# EAGLE design iridia-tam-main-board (EAGLE 6.4)

## Sheet 1 of 3
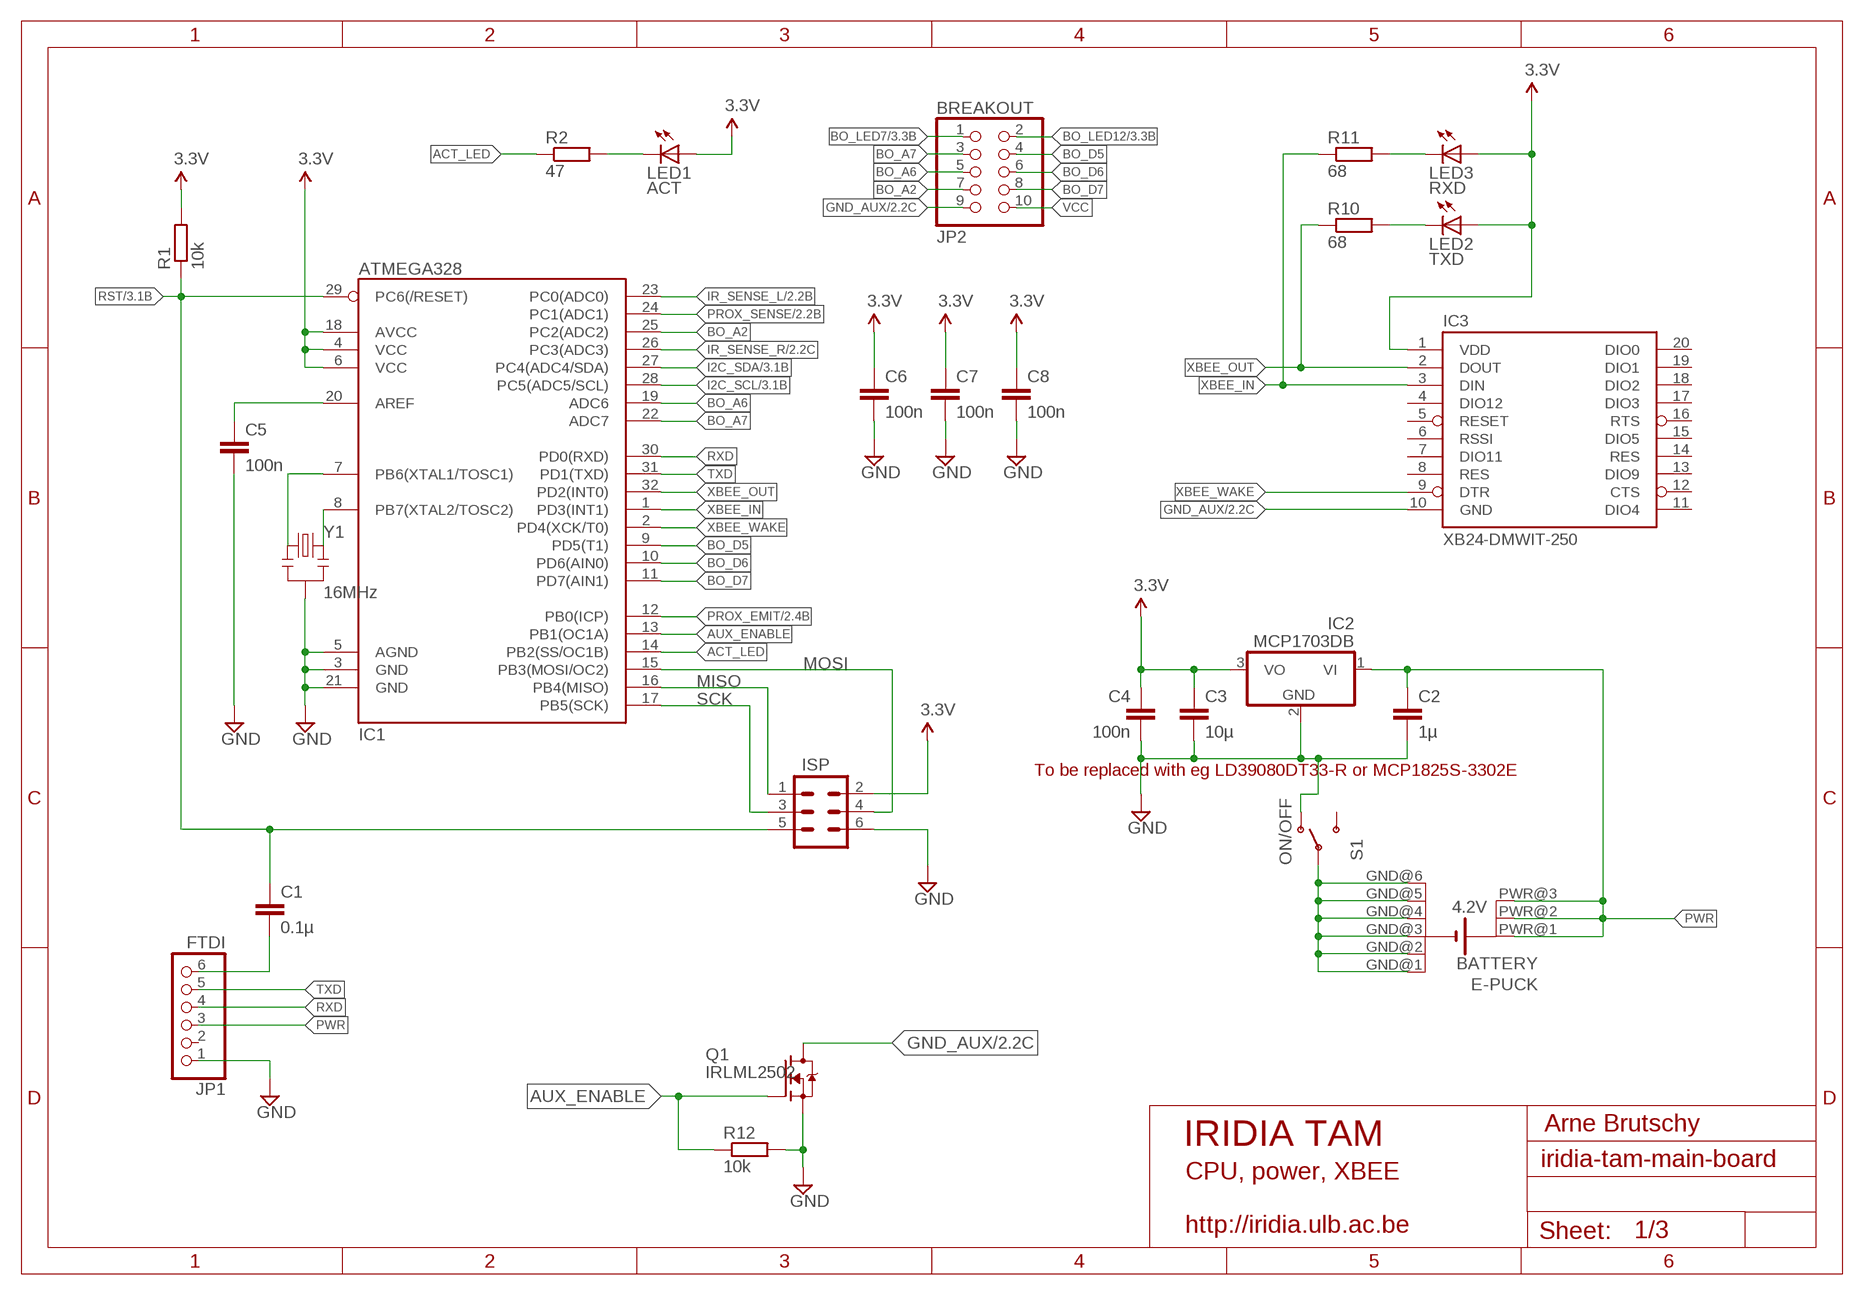
[diagram p0: schematic, sheet 1]

### Parts
BREAKOUT  JP2  PINHD-2X5_2.54-SMD  [2X05SMD]
C1  0.1µ  CAP0805  [0805]
C2  1µ  CAP0805  [0805]
C3  10µ  CAP0805  [0805]
C4  100n  CAP0805  [0805]
C5  100n  CAP0805  [0805]
C6  100n  CAP0805  [0805]
C7  100n  CAP0805  [0805]
C8  100n  CAP0805  [0805]
IC1  ATMEGA328  ATMEGA168  [TQFP32-08]
IC2  MCP1703DB  [SOT223]
IC3  XB24-DMWIT-250  XBEE-1B3  [XBEE-SMD]
JP1  FTDI  PINHD-1X6_2.54-SMD-90°  [1X06SMD/90]
LED1  ACT  LED1206  [LED-1206]
LED2  TXD  LEDCHIPLED_0805  [CHIPLED_0805]
LED3  RXD  LEDCHIPLED_0805  [CHIPLED_0805]
Q1  IRLML2502  [SOT23-3]
R1  10k  R-EU_R0805  [R0805]
R2  47  R-EU_R0805  [R0805]
R10  68  R-EU_R0805  [R0805]
R11  68  R-EU_R0805  [R0805]
R12  10k  R-EU_R0805  [R0805]
S1  ON/OFF  TOGGLESW200MSP1T2B2M6RE  [200USP1T1A1M6RE]
SV1  ISP  MA03-2  [MA03-2]
U$4  EPUCK_BATTERY  [EPUCK_BATTERY]
Y1  16MHz  RESONATOR16MHZ  [RESONATOR-SMD]

### Nets
ACT_LED: IC1.14(PB2(SS/OC1B)) R2.1
AUX_ENABLE: IC1.13(PB1(OC1A)) Q1.1(G) R12.1
BO_A2: BREAKOUT.7 IC1.25(PC2(ADC2))
BO_A6: BREAKOUT.5 IC1.19(ADC6)
BO_A7: BREAKOUT.3 IC1.22(ADC7)
BO_D5: BREAKOUT.4 IC1.9(PD5(T1))
BO_D6: BREAKOUT.6 IC1.10(PD6(AIN0))
BO_D7: BREAKOUT.8 IC1.11(PD7(AIN1))
BO_LED7: BREAKOUT.1 ; also sheet 3
BO_LED12: BREAKOUT.2 ; also sheet 3
FTDI_RST: C1.2 JP1.6
GND [gnd]: C2.2 C3.2 C4.2 C5.2 C6.2 C7.2 C8.2 IC1.3(GND) IC1.5(AGND) IC1.21(GND) IC2.2(GND) JP1.1 Q1.2(S) R12.2 S1.A SV1.6 Y1.2 ; also sheet 3
GND_AUX [gnd]: BREAKOUT.9 IC3.10(GND) Q1.3(D) ; also sheet 2,3
GND_BATT [gnd]: S1.COM U$4.GND@1(-1) U$4.GND@2(-2) U$4.GND@3(-3) U$4.GND@4(-4) U$4.GND@5(-5) U$4.GND@6(-6)
I2C_SCL: IC1.28(PC5(ADC5/SCL)) ; also sheet 3
I2C_SDA: IC1.27(PC4(ADC4/SDA)) ; also sheet 3
IR_SENSE_L: IC1.23(PC0(ADC0)) ; also sheet 2
IR_SENSE_R: IC1.26(PC3(ADC3)) ; also sheet 2
MISO: IC1.16(PB4(MISO)) SV1.1
MOSI: IC1.15(PB3(MOSI/OC2)) SV1.4
N$1: IC1.7(PB6(XTAL1/TOSC1)) Y1.1
N$8: C5.1 IC1.20(AREF)
N$11: IC1.8(PB7(XTAL2/TOSC2)) Y1.3
N$13: LED2.C R10.2
N$15: LED3.C R11.2
N$16: LED1.C R2.2
PROX_EMIT: IC1.12(PB0(ICP)) ; also sheet 2
PROX_SENSE: IC1.24(PC1(ADC1)) ; also sheet 2
PWR [power]: C2.1 IC2.1(VI) JP1.3 U$4.PWR@1(+1) U$4.PWR@2(+2) U$4.PWR@3(+3)
RST: C1.1 IC1.29(PC6(/RESET)) R1.1 SV1.5 ; also sheet 3
RXD: IC1.30(PD0(RXD)) JP1.4
SCK: IC1.17(PB5(SCK)) SV1.3
TXD: IC1.31(PD1(TXD)) JP1.5
VCC [power]: BREAKOUT.10 C3.1 C4.1 C6.1 C7.1 C8.1 IC1.4(VCC) IC1.6(VCC) IC1.18(AVCC) IC2.3(VO) IC3.1(VDD) LED1.A LED2.A LED3.A R1.2 SV1.2 ; supply symbol labelled 3.3V ; also sheet 2,3
XBEE_IN: IC1.1(PD3(INT1)) IC3.3(DIN) R11.1
XBEE_OUT: IC1.32(PD2(INT0)) IC3.2(DOUT) R10.1
XBEE_WAKE: IC1.2(PD4(XCK/T0)) IC3.9(DTR)
Unconnected: IC3.4(DIO12) IC3.5(RESET) IC3.6(RSSI) IC3.7(DIO11) IC3.8(RES) IC3.11(DIO4) IC3.12(CTS) IC3.13(DIO9) IC3.14(RES) IC3.15(DIO5) IC3.16(RTS) IC3.17(DIO3) IC3.18(DIO2) IC3.19(DIO1) IC3.20(DIO0) JP1.2 S1.B

### Notes on the sheet
- To be replaced with eg LD39080DT33-R or MCP1825S-3302E
- Arne Brutschy
- IRIDIA TAM
- CPU, power, XBEE
- http://iridia.ulb.ac.be

## Sheet 2 of 3
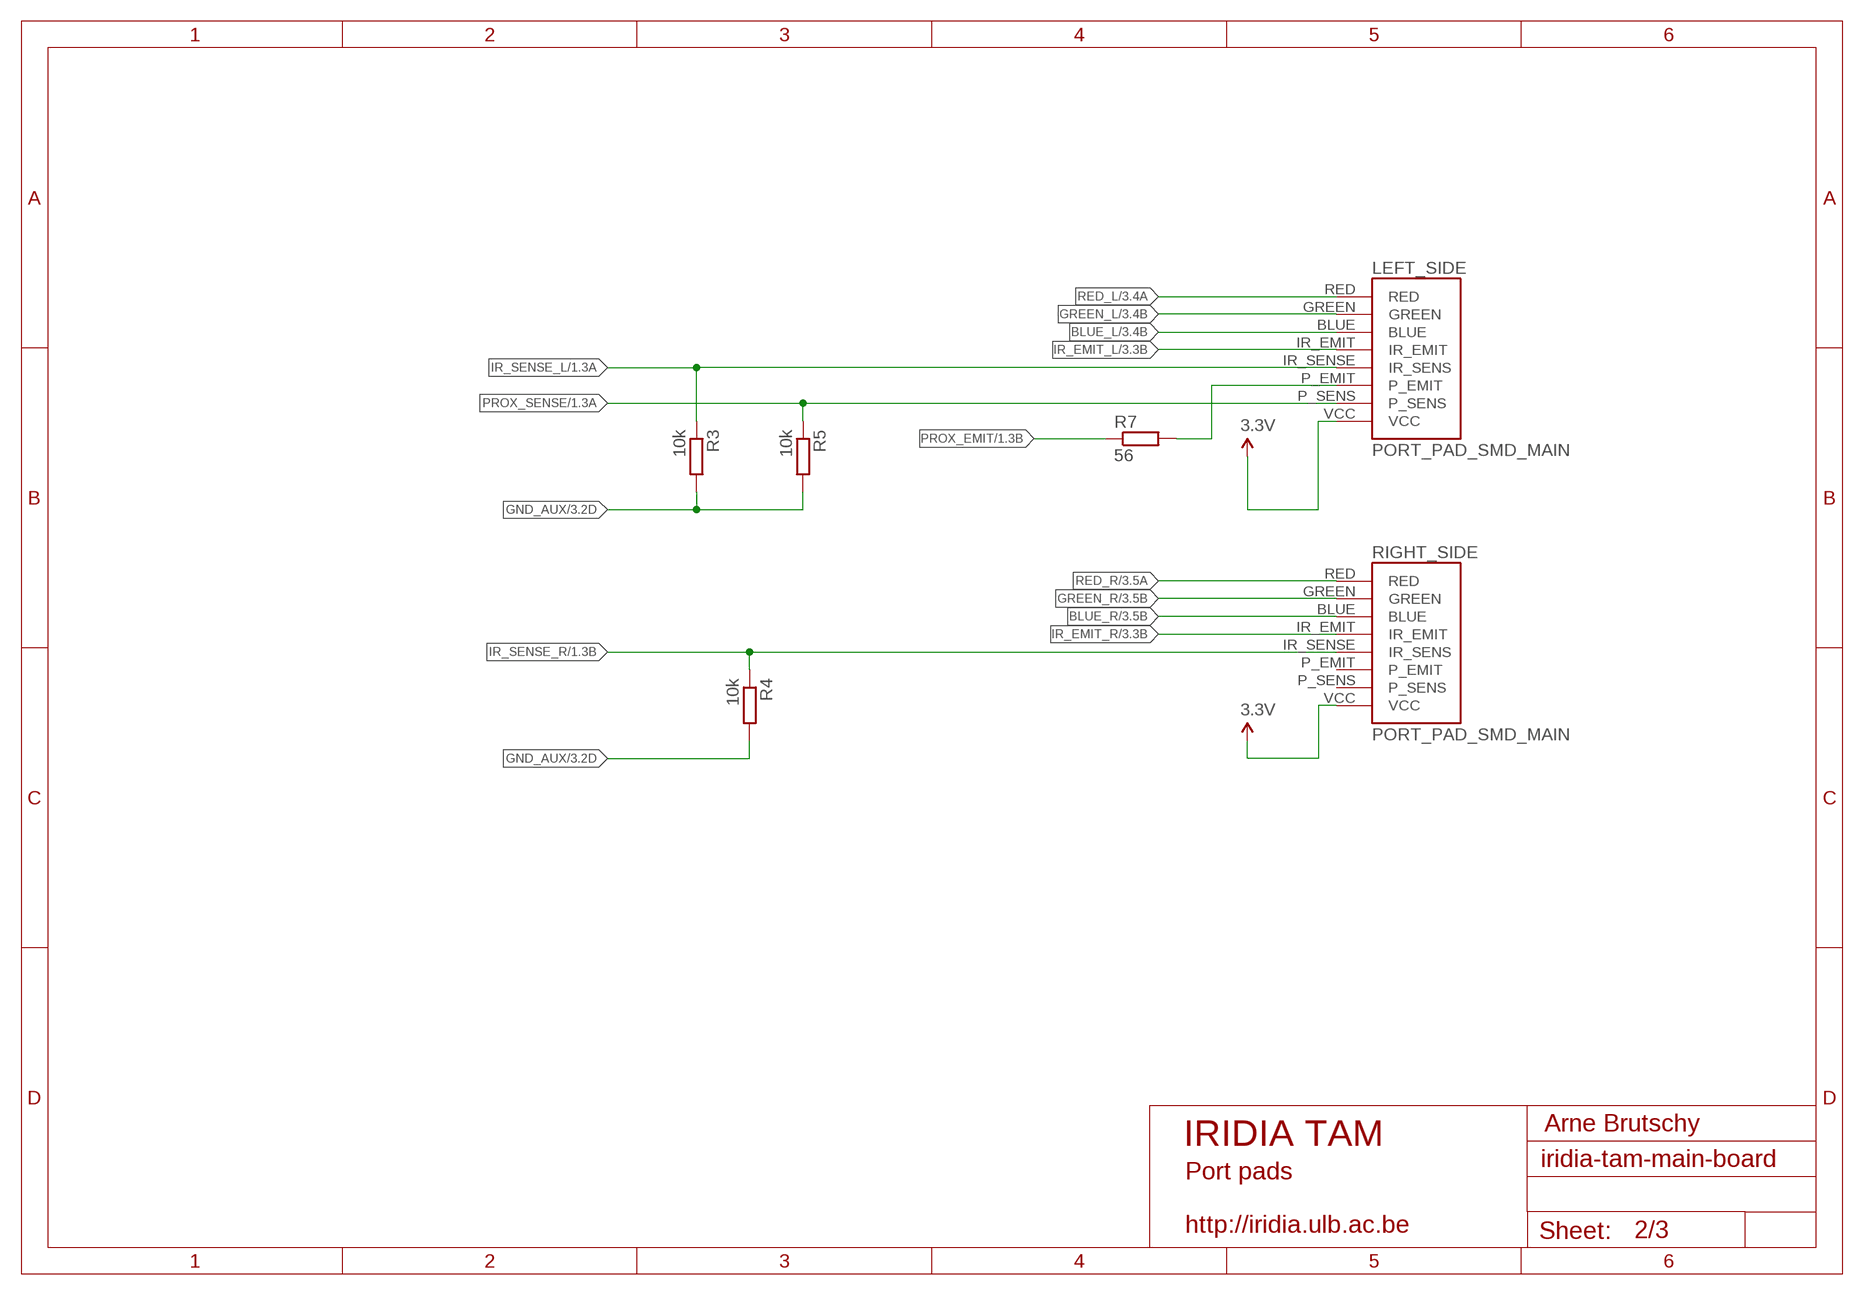
[diagram p1: schematic, sheet 2]

### Parts
LEFT_SIDE  PORT_PAD_SMD_MAIN  [PORT_PAD_SMD_MAIN]
R3  10k  R-EU_R0805  [R0805]
R4  10k  R-EU_R0805  [R0805]
R5  10k  R-EU_R0805  [R0805]
R7  56  R-EU_R0805  [R0805]
RIGHT_SIDE  PORT_PAD_SMD_MAIN  [PORT_PAD_SMD_MAIN]

### Nets
BLUE_L: LEFT_SIDE.BLUE ; also sheet 3
BLUE_R: RIGHT_SIDE.BLUE ; also sheet 3
GND_AUX [gnd]: R3.2 R4.2 R5.2 ; also sheet 1,3
GREEN_L: LEFT_SIDE.GREEN ; also sheet 3
GREEN_R: RIGHT_SIDE.GREEN ; also sheet 3
IR_EMIT_L: LEFT_SIDE.IR_EMIT ; also sheet 3
IR_EMIT_R: RIGHT_SIDE.IR_EMIT ; also sheet 3
IR_SENSE_L: LEFT_SIDE.IR_SENSE(IR_SENS) R3.1 ; also sheet 1
IR_SENSE_R: R4.1 RIGHT_SIDE.IR_SENSE(IR_SENS) ; also sheet 1
N$2: LEFT_SIDE.P_EMIT R7.2
PROX_EMIT: R7.1 ; also sheet 1
PROX_SENSE: LEFT_SIDE.P_SENS R5.1 ; also sheet 1
RED_L: LEFT_SIDE.RED ; also sheet 3
RED_R: RIGHT_SIDE.RED ; also sheet 3
VCC [power]: LEFT_SIDE.VCC RIGHT_SIDE.VCC ; supply symbol labelled 3.3V ; also sheet 1,3
Unconnected: RIGHT_SIDE.P_EMIT RIGHT_SIDE.P_SENS

### Notes on the sheet
- Arne Brutschy
- IRIDIA TAM
- Port pads
- http://iridia.ulb.ac.be

## Sheet 3 of 3
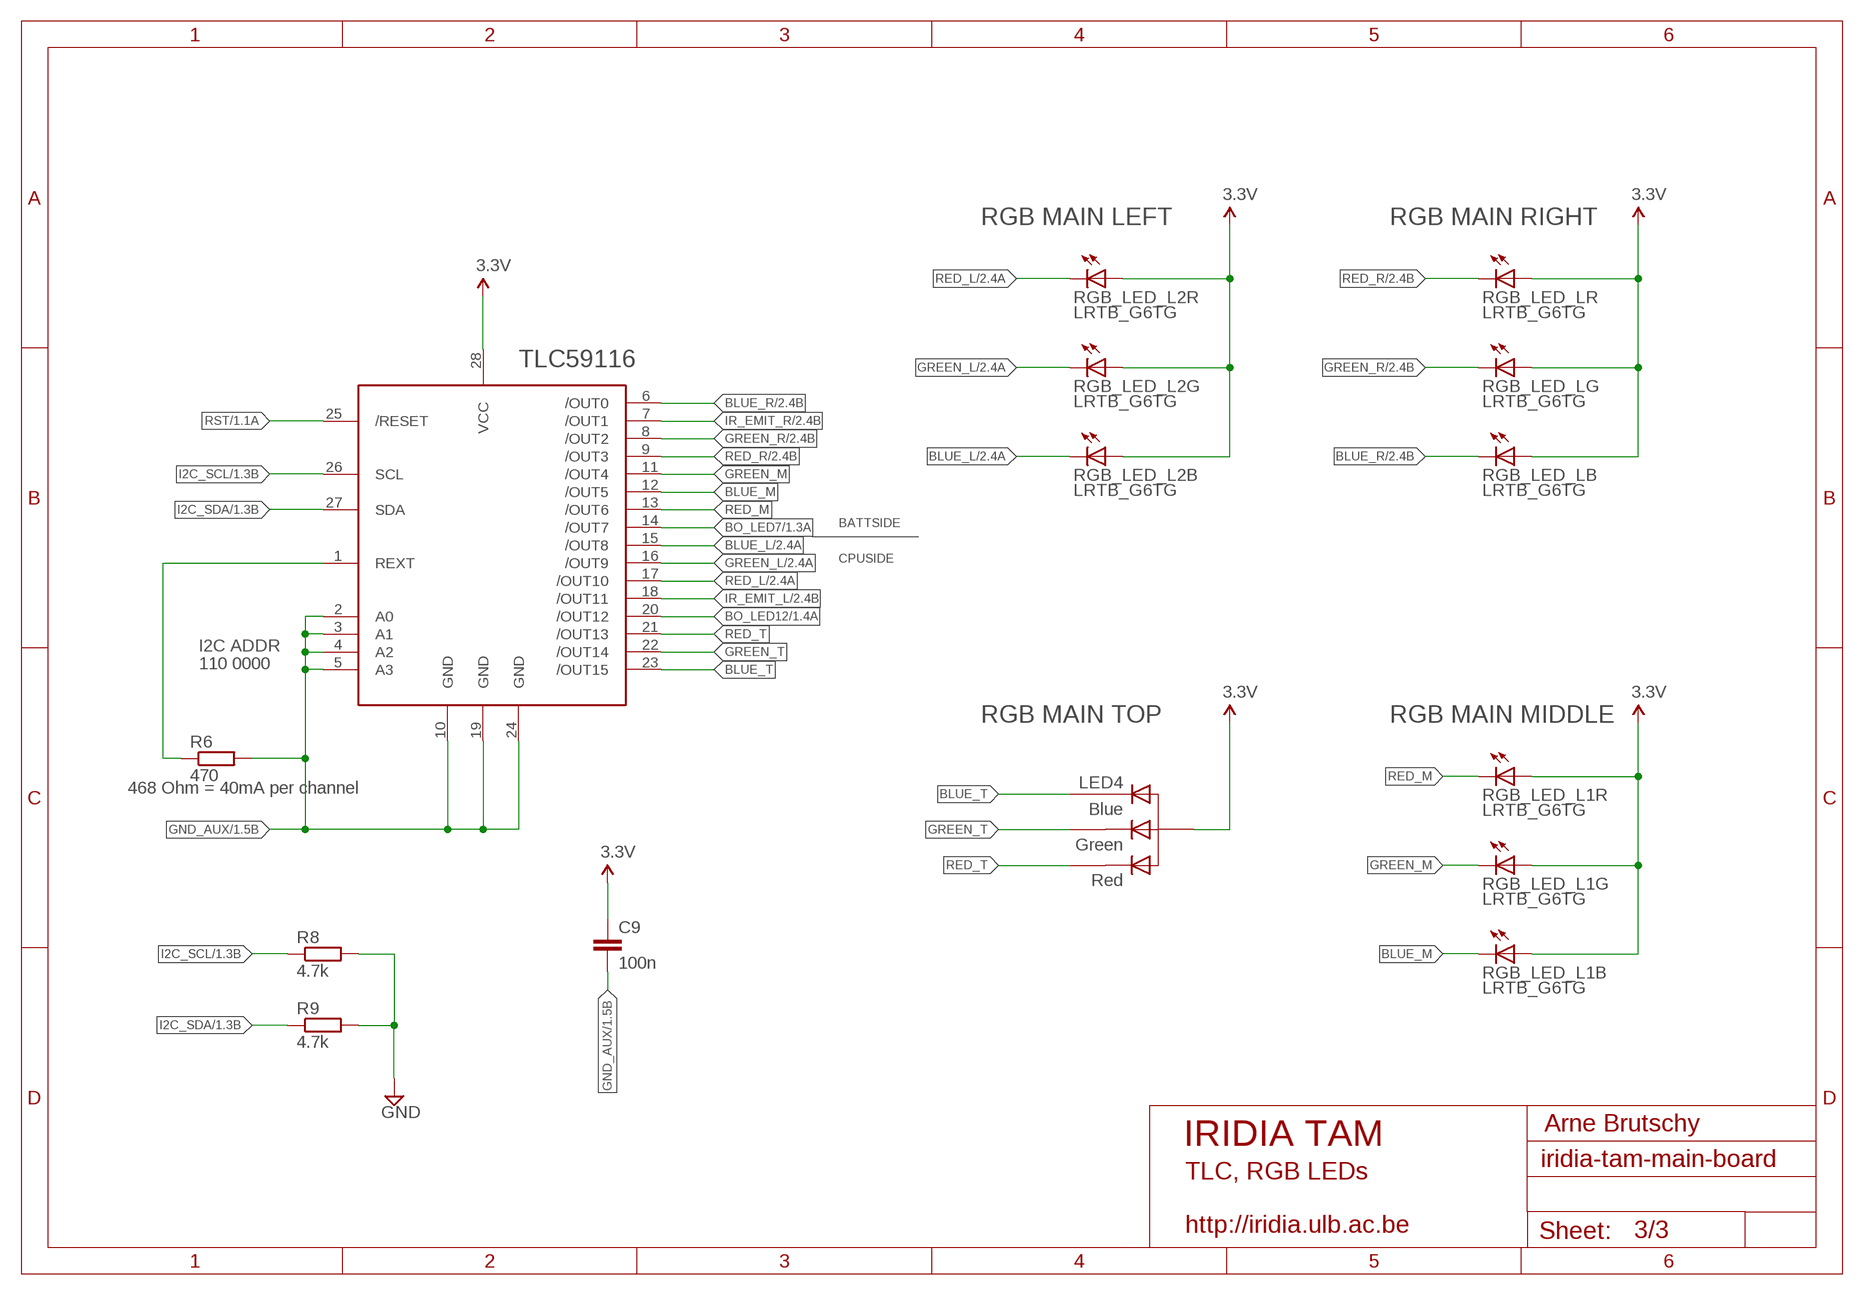
[diagram p2: schematic, sheet 3]

### Parts
C9  100n  CAP0805  [0805]
IC4  TLC59116  [TSSOP28]
LED4  RGBLED_CA5MMTROUGHHOLE  [LED5MMRGB]
R6  470  R-EU_R0805  [R0805]
R8  4.7k  R-EU_R0805  [R0805]
R9  4.7k  R-EU_R0805  [R0805]
RGB_LED_L  LRTB_G6TG  MULTILED_LRTB_G6TG  [P-LCC-6_TOPLED]
RGB_LED_L1  LRTB_G6TG  MULTILED_LRTB_G6TG  [P-LCC-6_TOPLED]
RGB_LED_L2  LRTB_G6TG  MULTILED_LRTB_G6TG  [P-LCC-6_TOPLED]

### Nets
BLUE_L: IC4.15(/OUT8) RGB_LED_L2.C3(B:C) ; also sheet 2
BLUE_M: IC4.12(/OUT5) RGB_LED_L1.C3(B:C)
BLUE_R: IC4.6(/OUT0) RGB_LED_L.C3(B:C) ; also sheet 2
BLUE_T: IC4.23(/OUT15) LED4.4(CB)
BO_LED7: IC4.14(/OUT7) ; also sheet 1
BO_LED12: IC4.20(/OUT12) ; also sheet 1
GND [gnd]: R8.2 R9.2 ; also sheet 1
GND_AUX [gnd]: C9.2 IC4.2(A0) IC4.3(A1) IC4.4(A2) IC4.5(A3) IC4.10(GND) IC4.19(GND) IC4.24(GND) R6.2 ; also sheet 1,2
GREEN_L: IC4.16(/OUT9) RGB_LED_L2.C2(G:C) ; also sheet 2
GREEN_M: IC4.11(/OUT4) RGB_LED_L1.C2(G:C)
GREEN_R: IC4.8(/OUT2) RGB_LED_L.C2(G:C) ; also sheet 2
GREEN_T: IC4.22(/OUT14) LED4.3(CG)
I2C_SCL: IC4.26(SCL) R8.1 ; also sheet 1
I2C_SDA: IC4.27(SDA) R9.1 ; also sheet 1
IR_EMIT_L: IC4.18(/OUT11) ; also sheet 2
IR_EMIT_R: IC4.7(/OUT1) ; also sheet 2
RED_L: IC4.17(/OUT10) RGB_LED_L2.C1(R:C) ; also sheet 2
RED_M: IC4.13(/OUT6) RGB_LED_L1.C1(R:C)
RED_R: IC4.9(/OUT3) RGB_LED_L.C1(R:C) ; also sheet 2
RED_T: IC4.21(/OUT13) LED4.1(CR)
REXT: IC4.1(REXT) R6.1
RST: IC4.25(/RESET) ; also sheet 1
VCC [power]: C9.1 IC4.28(VCC) LED4.2(A) RGB_LED_L1.A1(R:A) RGB_LED_L1.A2(G:A) RGB_LED_L1.A3(B:A) RGB_LED_L2.A1(R:A) RGB_LED_L2.A2(G:A) RGB_LED_L2.A3(B:A) RGB_LED_L.A1(R:A) RGB_LED_L.A2(G:A) RGB_LED_L.A3(B:A) ; supply symbol labelled 3.3V ; also sheet 1,2

### Notes on the sheet
- RGB MAIN LEFT | RGB MAIN RIGHT
- TLC59116
- BATTSIDE
- CPUSIDE
- I2C ADDR
- 110 0000
- RGB MAIN TOP | RGB MAIN MIDDLE
- 468 Ohm = 40mA per channel
- Arne Brutschy
- IRIDIA TAM
- TLC, RGB LEDs
- http://iridia.ulb.ac.be

## Library data of the parts
BREAKOUT = pinhead:PINHD-2X5: PIN HEADER
C1-C9 = SparkFun:CAP: Capacitor Standard 0603 ceramic capacitor, and 0.1" leaded capacitor.
IC1 = SparkFun:ATMEGA168
IC2 = linear:MCP1703: 250 mA, 16V, Low Quiescent Current LDO Regulator Source: http://ww1.microchip.com/downloads/en/DeviceDoc/22049b.pdf
IC3 = SparkFun-RF:XBEE-1: Xbee module footprints SMT header is CONN-09042.; PROD_ID: CONN-09042
IC4 = iridia:TLC59116: 16-CHANNEL FAST-MODE PLUS I2C BUS LED DRIVER Digi-Key Part Number 296-23354-1-ND Manufacturer Part Number TLC59116IPWR (TLC59116F)
JP1 = pinhead:PINHD-1X6: PIN HEADER
LED1 = SparkFun:LED: LEDs Standard schematic elements and footprints for 5mm, 3mm, 1206, and 0603 sized LEDs. 5mm - Spark Fun Electronics SKU : COM-00529 (and others)
LED2 LED3 = led:LED: LED OSRAM: - CHIPLED LG R971, LG N971, LY N971, LG Q971, LY Q971, LO R971, LY R971 LH N974, LH R974 LS Q976, LO Q976, LY Q976 LO Q996 - Hyper CHIPLED LW Q18S LB Q993, LB Q99A, LB R99A - SideLED LS A670, LO A670, LY A670, LG A670, LP A670 LB A673, LV A673, LT A673, LW A673 LH A674 LY A675 LS A676, LA A676, LO A676, LY A676, LW A676 LS A679, LY A679, LG A679 - Hyper Micro SIDELED® LS Y876, LA Y876, LO Y876, LY Y876 LT Y87S - SmartLED LW L88C, LW L88S LB L89C, LB L89S, LG L890 LS L89K, LO L89K, LY L89K LS L896, LA L896, LO L896, LY L896 - TOPLED LS T670, LO T670, LY T670, LG T670, LP T670 LSG T670, LSP T670, LSY T670, LOP T670, LYG T670 LG T671, LOG T671, LSG T671 LB T673, LV T673, LT T673, LW T673 LH T674 LS T676, LA T676, LO T676, LY T676, LB T676, LH T676, LSB T676, LW T676 LB T67C, LV T67C, LT T67C, LS T67K, LO T67K, LY T67K, LW E67C LS E67B, LA E67B, LO E67B, LY E67B, LB E67C, LV E67C, LT E67C LW T67C LS T679, LY T679, LG T679 LS T770, LO T770, LY T770, LG T770, LP T770 LB T773, LV T773, LT T773, LW T773 LH T774 LS E675, LA E675, LY E675, LS T675 LS T776, LA T776, LO T776, LY T776, LB T776 LHGB T686 LT T68C, LB T68C - Hyper Mini TOPLED® LB M676 - Mini TOPLED Santana® LG M470 LS M47K, LO M47K, LY M47K Source: http://www.osram.convergy.de LUXEON: - LUMILED® LXK2-PW12-R00, LXK2-PW12-S00, LXK2-PW14-U00, LXK2-PW14-V00 LXK2-PM12-R00, LXK2-PM12-S00, LXK2-PM14-U00 LXK2-PE12-Q00, LXK2-PE12-R00, LXK2-PE12-S00, LXK2-PE14-T00, LXK2-PE14-U00 LXK2-PB12-K00, LXK2-PB12-L00, LXK2-PB12-M00, LXK2-PB14-N00, LXK2-PB14-P00, LXK2-PB14-Q00 LXK2-PR12-L00, LXK2-PR12-M00, LXK2-PR14-Q00, LXK2-PR14-R00 LXK2-PD12-Q00, LXK2-PD12-R00, LXK2-PD12-S00 LXK2-PH12-R00, LXK2-PH12-S00 LXK2-PL12-P00, LXK2-PL12-Q00, LXK2-PL12-R00 Source: www.luxeon.com KINGBRIGHT: KA-3528ASYC Source: www.kingbright.com
LED4 = iridia:RGBLED_CA: RGB LED, common-anode 5MM Staggered pins YSL-R596AR3G4B5C-C10 https://www.sparkfun.com/products/10821 BL-L515RGBW-CA http://www.adafruit.com/products/159
LEFT_SIDE RIGHT_SIDE = iridia:PORT_PAD_SMD_MAIN: Connector pad for soldering side boards on main board of IRIDIA TAM
Q1 = iridia:IRLML2502: International Rectifier N-MOSFET.
R1-R12 = resistor:R-EU_: RESISTOR, European symbol
RGB_LED_L RGB_LED_L1 RGB_LED_L2 = led:MULTILED_LRTB_G6TG: 6-lead MULTILED® Enhanced optical Power LED (ThinFilm® / ThinGaN®) Source. OSRAM - LRTB_G6TG.pdf
S1 = iridia:TOGGLESW: Toggle Switches Digi-Key Part Number 432-1164-ND Manufacturer Carling Technologies Manufacturer Part Number 2M1-SP1-T2-B4-M6RE Description SW TOGGLE SPDT .4VA RT ANG PCB Digi-Key Part Number EG2448-ND Manufacturer E-Switch Manufacturer Part Number 200MSP1T2B2M6RE Description SWITCH TOGGLE SPDT .4VA RT ANG
SV1 = con-lstb:MA03-2: PIN HEADER
U$4 = iridia:EPUCK_BATTERY: E-Puck Battery Holder As on epuck charger
Y1 = iridia:RESONATOR: Resonator Digikey: CSTCE16M0V53-R0 Description CER RESONATOR 16.0MHZ SMD; PROD_ID: XTAL-08900

## Net classes
1 power: width 0.381 mm, clearance 0.254 mm
2 gnd: width 0.305 mm, drill 0.508 mm, clearance 0.152 mm

## Board
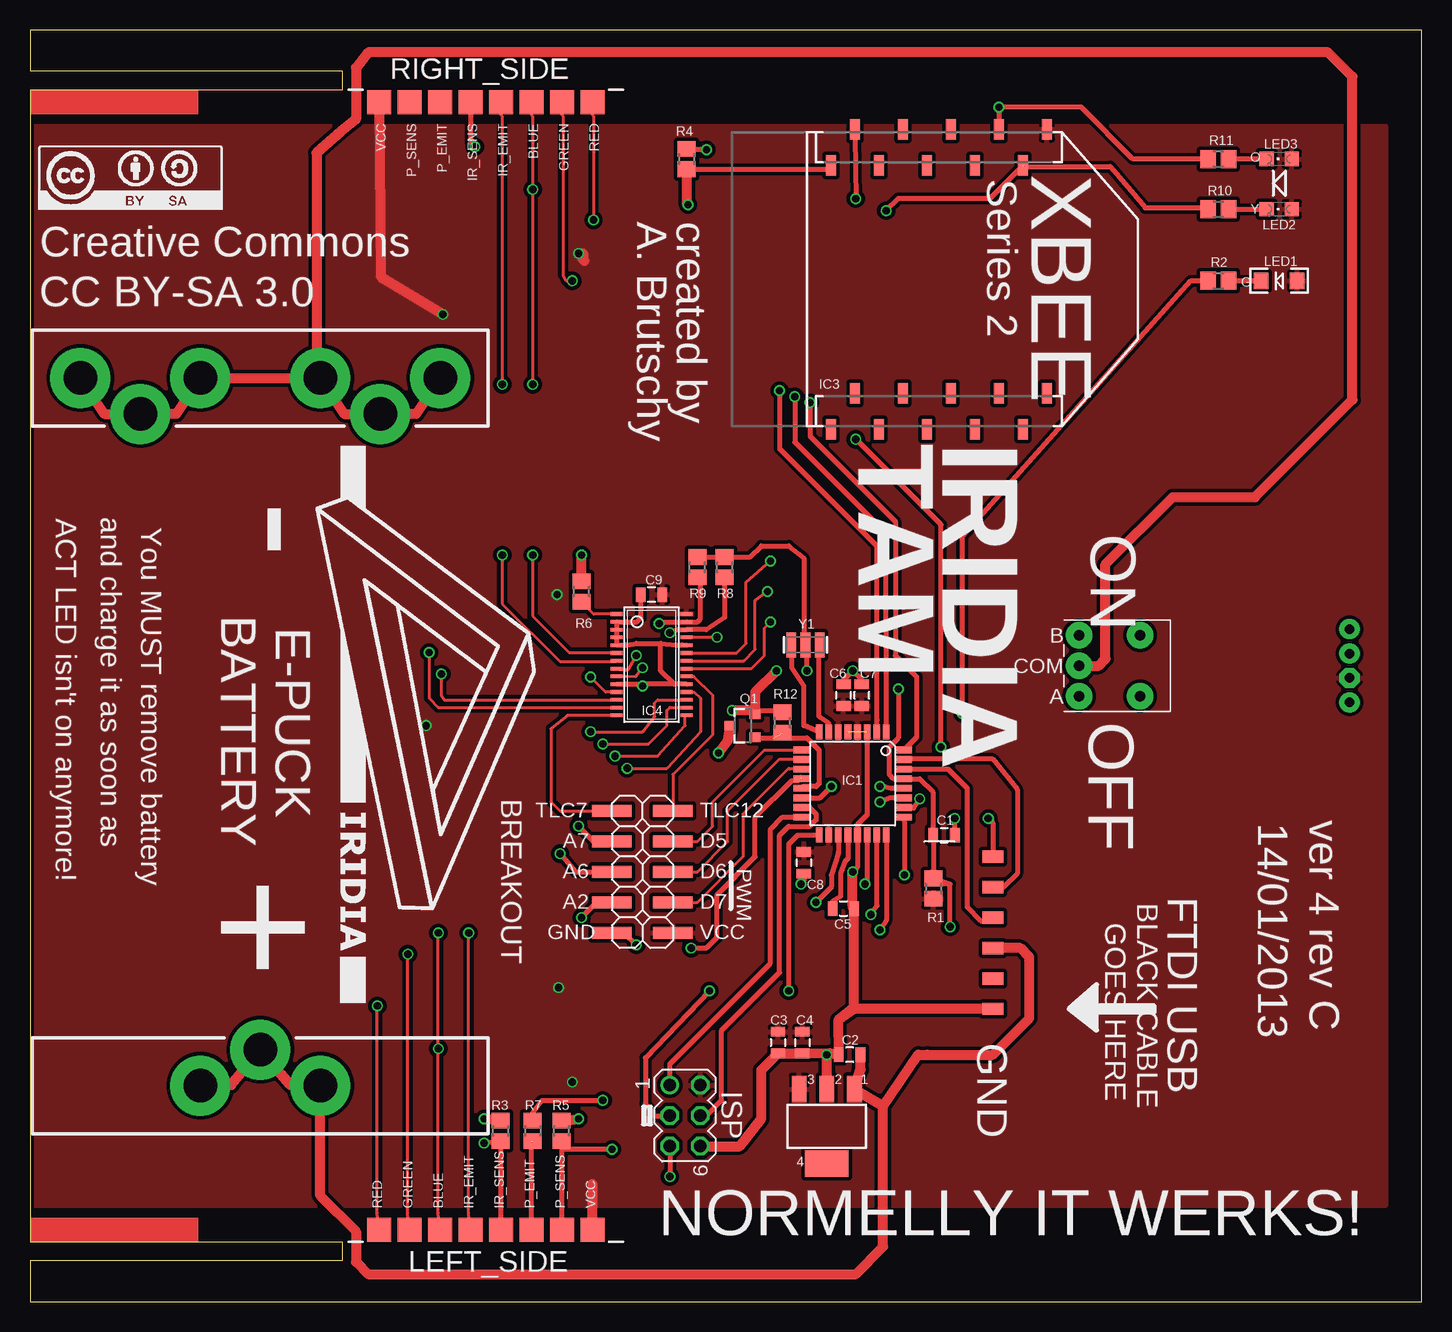
[diagram p3: board, top side]
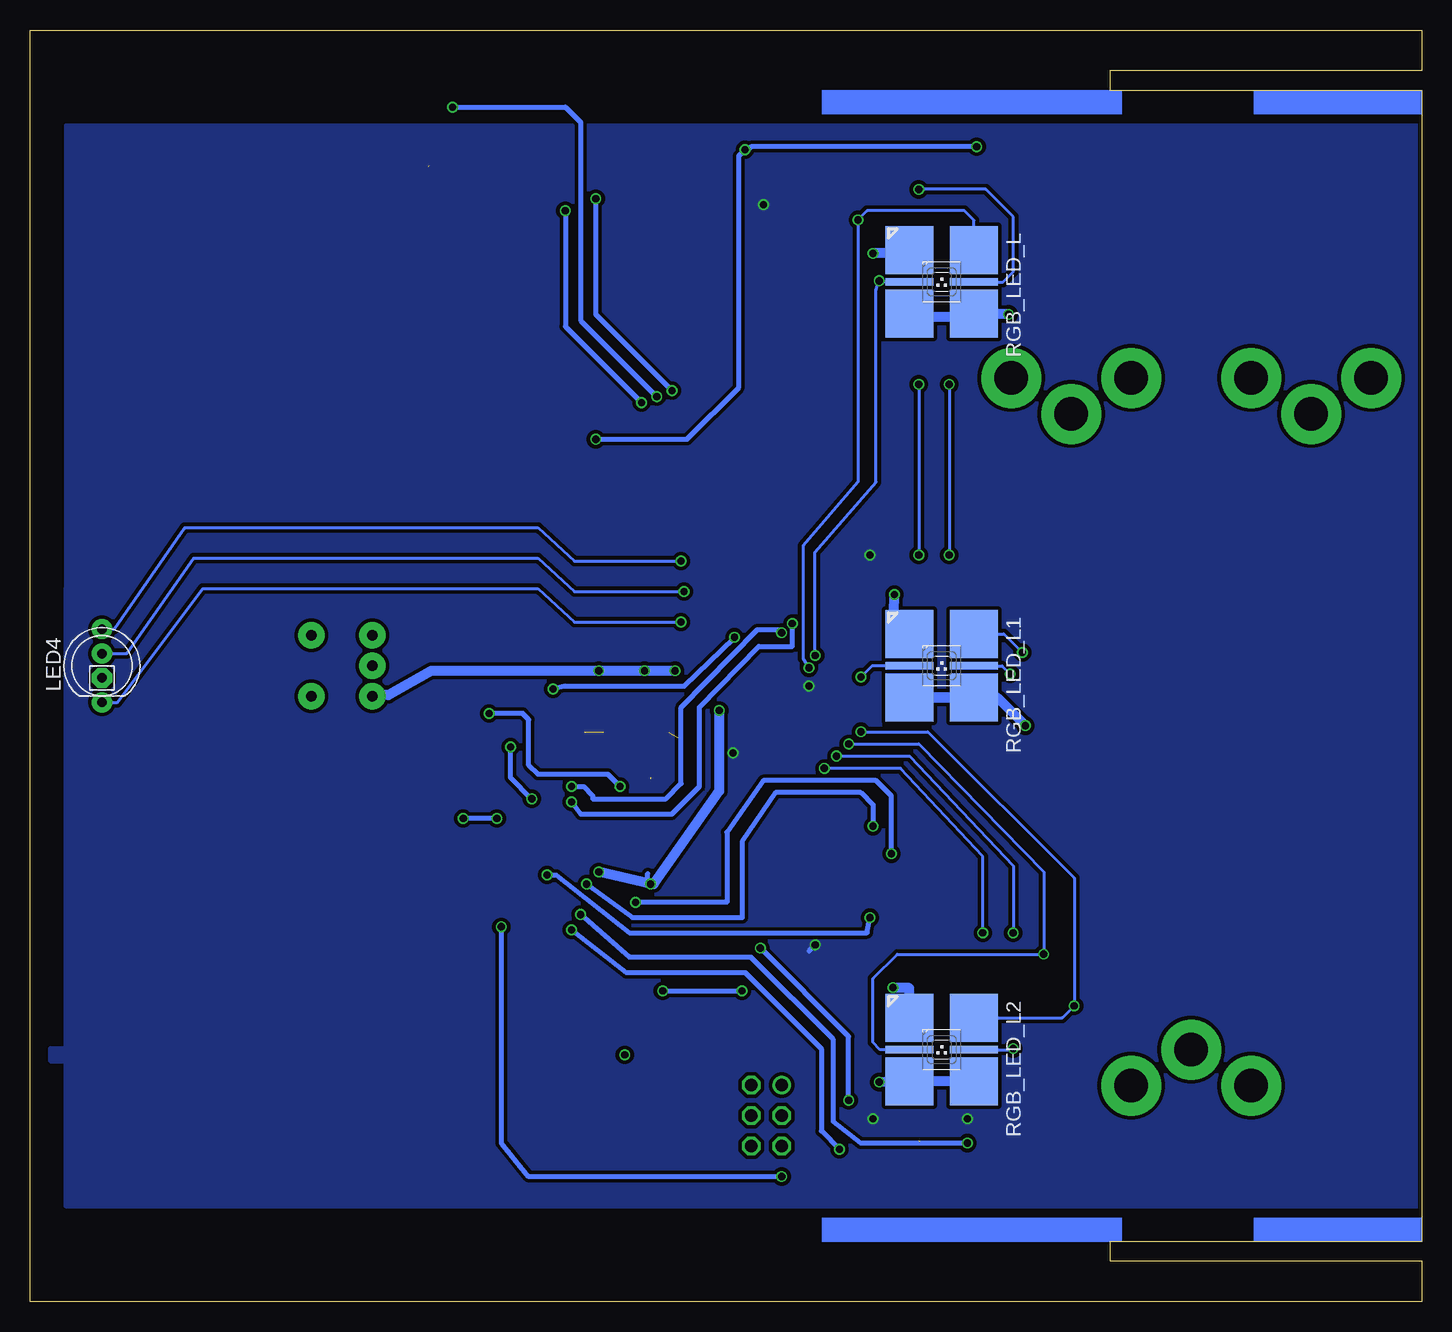
[diagram p4: board, bottom side, seen from below]

Size 116 x 106 mm. Coordinates in mm from the lower left corner, seen from the top.
Outline: 0,0 116,0 116,106 0,106 0,102.6 26,102.6 26,101 0,101 0,5 26,5 26,3.4 0,3.4 0,0
Copper layers (1*16): Top 0.035mm / dielectric 1.5mm / Bottom 0.035mm
Design rules "Fusion_eagle_rule_v1.1": minimum track width 6mil, minimum drill 12mil, track to track 6mil, track to pad 6mil, pad to pad 6mil, via to via 6mil, smd to smd 0mil, copper to edge 10mil, drill to drill 10mil, minimum pad ring 10mil, minimum via ring 6mil, stop-mask expansion 2mil, vias tented up to drill 100mil, thermal gap 10mil

### Footprints (pad centres in the part's own frame; a part is rotated, then mirrored left to right if it is on the bottom)
2X05SMD = smd 1.016 x 3.302: 1 -1.27,-3.81; 2 -1.27,1.27; 3 1.27,-3.81; 4 1.27,1.27; 5 3.81,-3.81; 6 3.81,1.27; 7 6.35,-3.81; 8 6.35,1.27; 9 8.89,-3.81; 10 8.89,1.27
0805 = smd 0.8 x 1.2: 1 -0.9,0; 2 0.9,0
TQFP32-08 = smd 1.27 x 0.559: 1 -4.293,2.8; 2 -4.293,2; 3 -4.293,1.2; 4 -4.293,0.4; 5 -4.293,-0.4; 6 -4.293,-1.2; 7 -4.293,-2; 8 -4.293,-2.8; 17 4.293,-2.8; 18 4.293,-2; 19 4.293,-1.2; 20 4.293,-0.4; 21 4.293,0.4; 22 4.293,1.2; 23 4.293,2; 24 4.293,2.8 | smd 0.559 x 1.27: 9 -2.8,-4.293; 10 -2,-4.293; 11 -1.2,-4.293; 12 -0.4,-4.293; 13 0.4,-4.293; 14 1.2,-4.293; 15 2,-4.293; 16 2.8,-4.293; 25 2.8,4.293; 26 2,4.293; 27 1.2,4.293; 28 0.4,4.293; 29 -0.4,4.293; 30 -1.2,4.293; 31 -2,4.293; 32 -2.8,4.293
SOT223 = smd 1.219 x 2.235: 1 -2.311,-3.099; 2 0,-3.099; 3 2.311,-3.099 | smd 3.6 x 2.2: 4 0,3.099
XBEE-SMD = smd 1.7 x 0.85: 1 -12.5,20; 2 -9.5,18; 3 -12.5,16; 4 -9.5,14; 5 -12.5,12; 6 -9.5,10; 7 -12.5,8; 8 -9.5,6; 9 -12.5,4; 10 -9.5,2; 11 12.5,2; 12 9.5,4; 13 12.5,6; 14 9.5,8; 15 12.5,10; 16 9.5,12; 17 12.5,14; 18 9.5,16; 19 12.5,18; 20 9.5,20
TSSOP28 = smd 0.305 x 0.991: 1 -4.225,-2.918; 2 -3.575,-2.918; 3 -2.925,-2.918; 4 -2.275,-2.918; 5 -1.625,-2.918; 6 -0.975,-2.918; 7 -0.325,-2.918; 8 0.325,-2.918; 9 0.975,-2.918; 10 1.625,-2.918; 11 2.275,-2.918; 12 2.925,-2.918; 13 3.575,-2.918; 14 4.225,-2.918; 15 4.225,2.918; 16 3.575,2.918; 17 2.925,2.918; 18 2.275,2.918; 19 1.625,2.918; 20 0.975,2.918; 21 0.325,2.918; 22 -0.325,2.918; 23 -0.975,2.918; 24 -1.625,2.918; 25 -2.275,2.918; 26 -2.925,2.918; 27 -3.575,2.918; 28 -4.225,2.918
1X06SMD/90 = smd 1.016 x 1.778: 1 -1.27,-5.08; 2 1.27,-5.08; 3 3.81,-5.08; 4 6.35,-5.08; 5 8.89,-5.08; 6 11.43,-5.08
LED-1206 = smd 1.2 x 1.4: A -1.5,0; C 1.5,0
CHIPLED_0805 = smd 1.2 x 1.2: A 0,-1.05; C 0,1.05
LED5MMRGB = drill 0.8 pad 1.676: 1 -3.048,0; 3 1.016,0; 4 3.048,0 | drill 0.8 pad 1.676 octagon: 2 -1.016,0
PORT_PAD_SMD_MAIN = smd 2 x 2: BLUE 0,3.81; GREEN 0,6.35; IR_EMIT 0,1.27; IR_SENSE 0,-1.27; P_EMIT 0,-3.81; P_SENS 0,-6.35; RED 0,8.89; VCC 0,-8.89
SOT23-3 = smd 0.8 x 0.9: 1 -0.95,-1; 2 0.95,-1; 3 0,1.1
R0805 = smd 1.3 x 1.5: 1 -0.85,0; 2 0.85,0
P-LCC-6_TOPLED = smd 4 x 4: A1 -2.65,-2.7; A2 2.65,-2.7; A3 2.65,2.7; C1 -2.65,2.7 | smd 0.6 x 4: C2 0,-2.7; C3 0,2.7
200USP1T1A1M6RE = drill 0.889 pad 2.184: 1 -2.54,2.54; 2 -2.54,-2.54; A 2.54,2.54; B 2.54,-2.54; COM 2.54,0
MA03-2 = drill 1.016: 1 -2.54,-1.27 | drill 1.016 octagon: 2 -2.54,1.27; 3 0,-1.27; 4 0,1.27; 5 2.54,-1.27; 6 2.54,1.27
EPUCK_BATTERY = drill 2.8 pad 5: GND@1 29,15; GND@2 26,10; GND@3 29,5; GND@4 29,-5; GND@5 26,-10; GND@6 29,-15; PWR@1 -30,5; PWR@2 -27,0; PWR@3 -30,-5
RESONATOR-SMD = smd 0.8 x 2.1: 1 -1.2,0; 2 0,0; 3 1.2,0

### Placement (x,y rotation side)
BREAKOUT  52.32,39.62 270 top
C1  76.2,38.86 0 top
C2  68.33,20.57 180 top
C3  62.36,21.59 270 top
C4  64.39,21.59 270 top
C5  67.82,32.77 0 top
C6  67.82,50.55 90 top
C7  69.34,50.55 90 top
C8  64.52,36.58 270 top
C9  51.82,58.93 180 top
IC1  68.58,43.18 270 top
IC2  66.42,14.61 180 top
IC3  64.77,85.22 270 top
IC4  51.82,53.09 270 top
JP1  75.18,25.65 90 top
LED1  104.14,85.09 180 top
LED2  104.14,91.06 90 top
LED3  104.14,95.25 90 top
LED4  110,53 90 bottom
LEFT_SIDE  38,6 90 top
Q1  59.44,48.01 90 top
R1  75.31,34.42 270 top
R2  99.06,85.09 0 top
R3  39.24,14.22 90 top
R4  54.74,95.25 270 top
R5  44.32,14.22 90 top
R6  45.97,59.18 90 top
R7  41.91,14.22 270 top
R8  57.91,61.21 90 top
R9  55.63,61.21 90 top
R10  99.06,91.06 0 top
R11  99.06,95.25 0 top
R12  62.74,48.26 90 top
RGB_LED_L  40,85 270 bottom
RGB_LED_L1  40,53 270 bottom
RGB_LED_L2  40,21 270 bottom
RIGHT_SIDE  38,100 270 top
S1  90,53 180 top
SV1  54.61,15.49 270 top
U$4  19.2,48 90 top
Y1  64.64,54.74 180 top

### Tracks (layer width: path | path; a pad name or v marks a point on that pad's centre or on a via)
ACT_LED  (via drill 0.6)
  Top 0.406: v77.72,49.02 77.72,63.75 96.77,85.09 98.3,85.09 | IC1.14 65.86,41.98 v66.8,42.93
  Top 0.813: R2.1 98.3,85.09
  Bottom 0.406: v66.8,42.93 67.82,43.94 73.66,43.94 74.42,44.7 74.42,48.51 74.93,49.02 v77.72,49.02
AUX_ENABLE  (1 unrouted)
  Top 0.406: Q1.1 60.69,46.97 61.98,46.99 64.77,46.99 65.79,45.97 65.79,43.18 65.53,42.93 64.43,42.93 IC1.13
BLUE_L  (via drill 0.6)
  Top 0.254: LEFT_SIDE.BLUE 34.04,7.37 v34.04,21.08 v34.04,30.73 34.04,30.99 | v48.77,45.47 52.32,45.47 54.61,48.01 54.61,48.74 IC4.15
  Bottom 0.254: RGB_LED_L2.C3 34.12,21 v34.04,21.08 | v48.77,45.47 42.67,45.47 34.04,36.32 v34.04,30.73
BLUE_M  (via drill 0.6)
  Top 0.254: v34.29,52.32 34.29,50.55 34.54,50.16 48.51,50.16 IC4.12
  Bottom 0.254: RGB_LED_L1.C3 34.97,53 v34.29,52.32
BLUE_R  (via drill 0.6)
  Top 0.254: RIGHT_SIDE.BLUE 41.81,98.91 41.91,98.81 v41.91,92.71 v41.91,76.45 | v41.91,62.23 41.91,57.15 44.96,54.1 48.86,54.1 IC4.6
  Bottom 0.254: RGB_LED_L.C3 34.89,85 34.04,85.85 34.04,90.42 36.32,92.71 v41.91,92.71 | v41.91,76.45 v41.91,62.23
BLUE_T  (via drill 0.6)
  Top 0.254: IC4.23 58.89,54.06 59.69,54.86 59.69,59.94 v61.72,61.72
  Bottom 0.254: LED4.4 108.97,56.05 103.12,64.52 73.66,64.52 70.61,61.72 v61.72,61.72
BO_A2  (via drill 0.6)
  Top 0.406: IC1.25 72.9,39.62 72.9,38.35 v72.9,35.56 | v45.97,32 47.24,33.27 BREAKOUT.7
  Bottom 0.406: v72.9,35.56 72.14,35.56 66.04,30.73 46.23,30.73 v45.97,32
BO_A6  (via drill 0.6)
  Top 0.406: IC1.19 67.38,37.41 66.8,35.56 66.8,34.54 v65.53,33.27 | v44.2,37.34 45.47,35.81 BREAKOUT.5
  Bottom 0.406: v44.2,37.34 44.2,42.16 45.47,43.43 54.86,43.43 57.91,39.12 57.91,33.27 v65.53,33.27
BO_A7  (via drill 0.6)
  Top 0.406: IC1.22 69.78,34.98 v69.6,34.8 | v45.72,39.62 46.99,38.35 BREAKOUT.3
  Bottom 0.406: v69.6,34.8 65.79,32 56.64,32 56.64,38.35 53.85,42.42 46.74,42.42 45.72,41.4 v45.72,39.62
BO_D5
  Top 0.254: BREAKOUT.4 55.63,38.35 56.9,39.62 56.9,41.66 61.21,45.97 IC1.9
BO_D6
  Top 0.254: BREAKOUT.6 55.63,35.81 58.17,38.35 58.17,40.89 62.48,45.21 64.25,45.21 IC1.10
BO_D7
  Top 0.254: IC1.11 63.32,44.38 63.25,44.45 59.44,40.64 59.44,37.08 55.63,33.27 BREAKOUT.8
BO_LED7
  Top 0.254: IC4.14 44.8,48.86 43.43,47.75 43.43,41.66 44.2,40.89 BREAKOUT.1
BO_LED12
  Top 0.254: IC4.20 55.33,52.11 56.9,50.55 56.9,47.24 53.59,43.94 BREAKOUT.2
FTDI_RST  (via drill 0.6)
  Top 0.406: C1.2 77.1,40.25 v77.09,40.26 | v79.88,40.26 80.26,39.88 JP1.6
  Bottom 0.406: v77.09,40.26 v79.88,40.26
GND  (via drill 0.6)  (1 unrouted)
  Top 0.406: 69.85,47.5 69.85,47.54 IC1.3 69.78,40.57 68.96,39.75 68.96,38.91 | 68.96,38.91 68.96,36.2 v68.58,35.81 | 68.96,38.91 IC1.21 | 60.44,49.26 62.59,49.26 R12.2 | v64.77,52.58 64.77,54.61 Y1.2 64.52,54.86 64.52,61.98 63.25,62.99 60.96,62.99 60.03,62.06 R8.2 R9.2 | C6.2 67.82,51.82 v68.58,52.58 69.34,51.82 C7.2 | C8.2 64.52,35.05 v64.26,34.8 64.26,35.42 C8.2
  Top 0.813: 66.67,20.71 C2.2 | IC2.2 v66.42,20.57 66.67,20.71 | 66.67,20.71 C4.2 C3.2 60.96,19.29 60.96,15.24 59.18,12.95 SV1.6 | Q1.2 60.44,49.26 | 60.44,49.26 v58.55,49.28 | C2.2 67.4,23.49 | 67.4,23.49 68.7,24.38 | 68.7,24.38 68.7,32.63 68.58,33.02 | C2.2 67.43,20.69 | 68.82,24.51 68.7,24.38 | v62.23,52.58 60.45,50.8 60.44,49.26 | 68.58,33.02 v68.58,35.81 | 68.58,33.02 68.58,32.88 C5.2 | JP1.1 68.7,24.38 | 68.7,24.38 68.54,24.38 67.4,23.49
  Bottom 0.406: v64.26,34.8 64.52,34.8 C8.2
  Bottom 0.813: v62.23,52.58 v64.77,52.58 v68.58,52.58 82.55,52.58 86.11,50.55 87.37,50.55 S1.A | v58.55,49.28 58.55,42.55 64.01,34.8 v64.26,34.8 v68.58,35.81
GND_AUX  (via drill 0.6)
  Top 0.406: 52.58,54.86 50.55,54.86 49.76,54.71 IC4.5 IC4.4 48.9,55.5 | 52.58,54.86 53.85,54.74 54.38,54.74 IC4.24 | 52.58,54.86 52.58,52.58 53.7,51.46 IC4.19 51.21,51.46 v51.05,51.31 50.9,51.46 IC4.10 | 48.9,55.5 IC4.3 IC4.2 50.56,56.66 | 48.9,55.5 48.77,55.37 | BREAKOUT.9 49.53,30.73 v50.55,29.72 | R4.2 66.45,94.4 IC3.10 | C9.2 50.92,57.01 50.56,56.66 | 50.56,56.66 50.55,56.64
  Top 0.813: R4.2 54.74,91.57 v54.86,91.44 | R6.2 v45.97,62.23 | Q1.3 58.17,46.74 v57.4,45.72 | R3.2 39.24,15.11 v37.85,15.24 | R5.2 44.54,15.07 v45.72,15.24
  Bottom 0.406: v50.55,29.72 50.8,29.72 50.8,29.46 51.05,29.21
  pour Bottom (isolate 0.305): 0,98 113,98 113.03,21.08 114.3,21.08 114.3,20.07 113.03,20.07 113.03,8 0,8
GND_BATT
  Top 0.813: S1.COM 89.07,53 89.66,53.59 89.66,61.47 95.25,67.06 102.11,67.06 110.24,75.18 110.24,102.11 108.2,104.14 28.19,104.14 27.18,102.87 27.18,98.55 25.91,97.54 23.88,95.76 23.88,77.12 U$4.GND@4 | U$4.GND@1 6.2,74 U$4.GND@2 12.2,74 U$4.GND@3 U$4.GND@4 | U$4.GND@4 26.2,74 U$4.GND@5 32.2,74 U$4.GND@6
GREEN_L  (via drill 0.6)
  Top 0.254: LEFT_SIDE.GREEN 31.5,7.37 v31.5,28.96 | v47.75,46.48 51.56,46.48 53.09,48.01 53.09,49.28 53.34,49.53 54.72,49.53 IC4.16
  Bottom 0.254: RGB_LED_L2.C2 45.13,21 45.72,21.59 45.72,26.92 43.69,28.96 v31.5,28.96 31.5,35.81 41.91,46.48 v47.75,46.48
GREEN_M  (via drill 0.6)
  Top 0.254: IC4.11 47.99,50.81 v46.74,52.07
  Bottom 0.254: v46.74,52.07 45.81,53 RGB_LED_L1.C2
GREEN_R  (via drill 0.6)
  Top 0.254: RIGHT_SIDE.GREEN 44.35,98.91 44.45,98.81 44.45,85.6 44.7,85.09 v45.21,85.09 | IC4.8 49.1,52.7 49.91,52.7 v50.55,53.85
  Bottom 0.254: RGB_LED_L.C2 45.12,85 v45.21,85.09 45.47,84.33 45.47,68.33 50.55,62.48 v50.55,53.85
GREEN_T  (via drill 0.6)
  Top 0.254: v61.47,59.18 60.45,58.42 60.45,54.36 59.51,53.41 IC4.22
  Bottom 0.254: LED4.3 107.96,54.02 102.36,61.98 73.66,61.98 70.61,59.18 v61.47,59.18
I2C_SCL  (via drill 0.6)
  Top 0.254: IC4.26
  Top 0.406: IC1.28 71.74,42.78 71.12,42.93 v70.87,42.93 | v53.34,55.75 53.98,56.01 IC4.26 | R8.1 57.91,57.02 56.39,56.01 IC4.26
  Bottom 0.406: v70.87,42.93 69.85,42.93 69.09,42.16 69.09,41.91 62.99,41.91 61.72,43.18 61.72,49.53 55.37,56.01 53.59,56.01 v53.34,55.75
I2C_SDA  (via drill 0.6)
  Top 0.305: 54.72,56.64 IC4.27
  Top 0.406: IC1.27 71.7,41.98 v70.87,41.66 | v52.45,56.52 52.45,56.64 54.72,56.64 | IC4.27 55.65,56.66 55.88,56.9 55.88,60.11 R9.1
  Bottom 0.406: v70.87,41.66 70.1,40.64 62.48,40.64 60.2,42.93 60.2,49.53 55.24,54.61 52.45,54.61 v52.45,56.52
IR_EMIT_L  (via drill 0.6)
  Top 0.254: LEFT_SIDE.IR_EMIT 36.58,7.37 v36.58,30.73 | IC4.18 55.36,50.81 55.88,50.29 55.88,47.5 53.09,44.45 v49.78,44.45
  Bottom 0.254: v36.58,30.73 36.58,37.08 43.43,44.45 v49.78,44.45
IR_EMIT_R  (via drill 0.6)
  Top 0.254: RIGHT_SIDE.IR_EMIT 39.27,98.91 39.37,98.81 v39.37,76.45 | v39.37,62.23 39.37,58.17 44.2,53.34 48.83,53.34 IC4.7
  Bottom 0.254: v39.37,76.45 v39.37,62.23
IR_SENSE_L  (via drill 0.6)
  Top 0.406: LEFT_SIDE.IR_SENSE 39.24,6.03 R3.1 39.28,13.37 v37.85,13.21 | v70.1,32.26 70.61,33.02 70.61,38.85 IC1.23
  Bottom 0.406: v37.85,13.21 46.74,13.21 49.02,14.99 49.02,21.84 55.88,28.7 66.04,28.7 v70.1,32.26
IR_SENSE_R  (via drill 0.6)
  Top 0.406: v74.17,41.91 73.65,41.14 73.62,41.18 IC1.26 | v75.95,46.23 75.95,64.77 v68.83,71.88 | v56.39,96.01 54.83,96.01 R4.1 | RIGHT_SIDE.IR_SENSE 36.73,96.62 v37.08,96.27
  Bottom 0.406: v74.17,41.91 75.95,43.69 v75.95,46.23 | v68.83,71.88 61.21,71.88 56.9,76.2 56.9,95.5 v56.39,96.01 56.39,95.76 55.88,96.27 v37.08,96.27
MISO
  Top 0.406: SV1.1 53.34,19.81 61.72,28.19 61.72,39.34 62.74,40.39 63.78,40.41 IC1.16
MOSI
  Top 0.406: SV1.4 56.39,15.49 57.66,16.76 57.66,22.61 62.48,27.43 62.48,38.86 63.25,39.62 65.02,39.62 65.53,40.13 65.53,40.64 64.99,41.18 IC1.15
N$1
  Top 0.406: IC1.7 66.58,48.23 65.79,48.77 65.79,54.68 Y1.1
N$2  (1 unrouted)
  Top 0.406: LEFT_SIDE.P_EMIT 41.81,13.36 41.91,13.46
N$8
  Top 0.406: IC1.20 68.2,38.89 68.2,36.96 67.94,36.7 67.56,35.7 67.56,33.78 66.92,33.39 C5.1
N$11
  Top 0.406: IC1.8 64.52,48.01 64.51,51.05 64.51,51.31 63.5,52.83 63.5,54.68 Y1.3
N$13
  Top 0.406: R10.2 LED2.C
N$15
  Top 0.406: LED3.C R11.2
N$16
  Top 0.406: R2.2 LED1.C
PROX_EMIT  (via drill 0.6)  (1 unrouted)
  Top 0.406: 64.26,43.69 64.01,43.43 63.5,43.43 60.45,40.39 60.45,37.08 57.28,33.91 57.28,30.35 56.39,29.46 v55.12,29.46 | R7.1 41.91,15.75 42.67,16.76 v47.75,16.76
  Bottom 0.406: v47.75,16.76 47.75,22.1 v55.12,29.46
PROX_SENSE  (via drill 0.6)
  Top 0.406: LEFT_SIDE.P_SENS 44.32,6.03 R5.1 44.41,12.7 v48.51,12.7 | IC1.24 71.38,31.76 v70.87,30.99
  Bottom 0.406: v70.87,30.99 66.29,27.43 56.39,27.43 50.04,21.08 50.04,14.22 v48.51,12.7
PWR
  Top 0.813: 71.12,16.26 71.12,4.57 68.83,2.29 28.19,2.29 27.18,3.3 27.18,5.84 24.2,8.82 U$4.PWR@3 21.69,18.05 U$4.PWR@2 19.18,20.95 16.78,18.05 U$4.PWR@1 | 71.12,16.26 68.96,17.53 68.78,17.53 68.78,17.65 IC2.1 69.24,19.32 C2.1 | 71.12,16.26 74.04,20.57 74.79,20.56 80.25,20.56 83.31,23.62 83.31,28.7 82.55,29.46 JP1.3
RED_L  (via drill 0.6)
  Top 0.254: LEFT_SIDE.RED 28.96,7.37 v28.96,24.64 | v46.74,47.5 51.05,47.5 52.07,48.77 52.07,49.91 52.32,50.16 54.48,50.16 IC4.17
  Bottom 0.254: RGB_LED_L2.C1 29.94,23.65 v28.96,24.64 28.96,35.31 41.15,47.5 v46.74,47.5
RED_M  (via drill 0.6)
  Top 0.254: v33.27,54.1 33.27,50.29 34.04,49.53 48.88,49.53 IC4.13
  Bottom 0.254: RGB_LED_L1.C1 34.82,55.65 v33.27,54.1
RED_R  (via drill 0.6)
  Top 0.254: RIGHT_SIDE.RED 46.89,98.91 46.99,98.81 v46.99,90.17 | v51.05,52.83 50.46,52.07 IC4.9
  Bottom 0.254: RGB_LED_L.C1 37.3,90.13 38.1,90.93 46.23,90.93 v46.99,90.17 46.99,68.33 51.56,62.99 51.56,53.59 v51.05,52.83
RED_T  (via drill 0.6)
  Top 0.254: IC4.21 60.13,52.76 61.21,53.85 61.21,56.13 v61.72,56.64
  Bottom 0.254: LED4.1 108.72,49.95 101.6,59.44 73.66,59.44 70.61,56.64 v61.72,56.64
REXT
  Top 0.254: IC4.1 46.99,57.31 R6.1
RST  (via drill 0.6)
  Top 0.254: v57.28,55.37 54.74,55.37 IC4.25
  Top 0.406: 75.31,38.86 75.31,42.42 74.15,43.58 IC1.29 71.99,43.58 71.63,43.94 71.63,46.23 72.39,46.99 v72.39,51.05 | C1.1 75.31,38.86 | SV1.5 v53.34,10.41 | 75.31,38.86 R1.1 75.31,35.18 | v76.71,31.24 76.71,34.8 | 75.18,35.05 76.71,34.8 | 75.18,35.31 75.18,35.56 | 75.18,35.56 75.44,35.81 75.44,35.56 75.18,35.31 | 75.18,35.31 76.71,34.8 | 76.71,34.8 74.93,34.8 75.18,35.05 | 75.44,35.31 75.18,35.05 | 75.69,35.05 75.44,35.05 | 75.44,35.05 75.18,35.05 | 75.18,35.05 75.18,35.31 | 75.44,35.05 75.18,35.81 75.18,35.56 | 75.18,35.31 75.44,35.05
  Top 0.813: R1.1 75.4,35.27 | 75.4,35.27 75.44,35.31 | 75.4,35.27 75.18,35.05
  Bottom 0.406: v72.39,51.05 71.37,51.31 61.47,51.31 v57.28,55.37 | v53.34,10.41 74.42,10.41 76.71,13.21 v76.71,31.24
RXD
  Top 0.406: IC1.30 76.52,44.38 78.11,42.8 78.11,32.89 79.25,31.75 80.01,31.75 JP1.4
SCK  (via drill 0.6)
  Top 0.406: IC1.17 64.01,38.89 63.25,38.1 v63.25,25.91 | v56.64,25.91 51.31,20.32 51.31,16.51 52.07,15.49 SV1.3
  Bottom 0.406: v63.25,25.91 v56.64,25.91
TXD
  Top 0.406: IC1.31 72.91,45.21 80.26,45.21 82.3,42.67 82.3,35.69 81.15,34.54 JP1.5
VCC  (via drill 0.6)
  Top 0.813: LEFT_SIDE.VCC 46.89,9.81 | RIGHT_SIDE.VCC 29.24,85.44 v34.42,82.3 | v45.72,87.38 46.1,87.38 46.1,86.87 46.23,86.74
  Bottom 0.406: 42.67,82.55 42.67,82.38 RGB_LED_L.A2 | RGB_LED_L.A1 42.67,87.63
  Bottom 0.813: RGB_LED_L2.A3 RGB_LED_L2.A2 44.13,18.35 v45.21,18.29 | v34.42,82.3 37.35,82.3 | 42.93,82.3 42.67,82.55 42.16,82.04 37.34,82.04 37.59,82.3 37.35,82.3 | 42.67,87.63 42.93,87.38 v45.72,87.38 | 37.35,82.3 RGB_LED_L.A3 | RGB_LED_L1.A3 RGB_LED_L1.A2 35.36,50.35 v33.02,48.01 | v43.94,58.93 43.97,57.38 RGB_LED_L1.A1 42.7,56.23 | RGB_LED_L2.A1 42.7,26.13 v44.07,26.16
  pour Top (isolate 0.305): 0,98 113,98 113,8 0,8
XBEE_IN  (via drill 0.6)
  Top 0.406: v63.75,75.44 63.75,71.63 71.38,64 71.37,62.99 71.38,49.54 IC1.1 | R11.1 91.95,95.25 87.63,99.57 v80.77,99.57 IC3.3
  Bottom 0.406: v63.75,75.44 70.1,81.79 70.1,98.3 71.37,99.57 v80.77,99.57
XBEE_OUT  (via drill 0.6)  (1 unrouted)
  Top 0.406: IC3.2 82.77,94.71 80.01,91.95 72.39,91.95 v71.37,90.93 | v65.02,74.93 65.02,72.14 72.14,65.02 72.14,53.85 73.91,52.07 73.91,47.02 IC1.32 | 82.8,94.61 90.04,94.61 92.96,91.19 98.08,91.19 R10.1
  Bottom 0.406: v71.37,90.93 71.37,81.28 v65.02,74.93
XBEE_WAKE  (via drill 0.6)
  Top 0.406: IC1.2 70.61,48.51 70.61,62.99 62.48,71.12 v62.48,75.95 | IC3.9 68.77,97.09 v68.83,91.95
  Bottom 0.406: v68.83,91.95 68.83,82.3 v62.48,75.95
(copper drawn outside any net)
  shapes: Bottom area x4, Top area x2

### Text on the board
tPlace: O | Series 2 | XBEE | Y | A. Brutschy | created by | Creative Commons | G | CC BY-SA 3.0 | TAM | IRIDIA | ACT LED isn't on anymore! | and charge it as soon as | You MUST remove battery | 14/01/2013 | ver 4 rev C | NORMELLY IT WERKS!
tNames: ON | OFF | TLC7 | TLC12 | A7 | D5 | PWM | A6 | D6 | FTDI USB | A2 | D7 | BLACK CABLE | GOES HERE | GND | VCC | GND | ISP